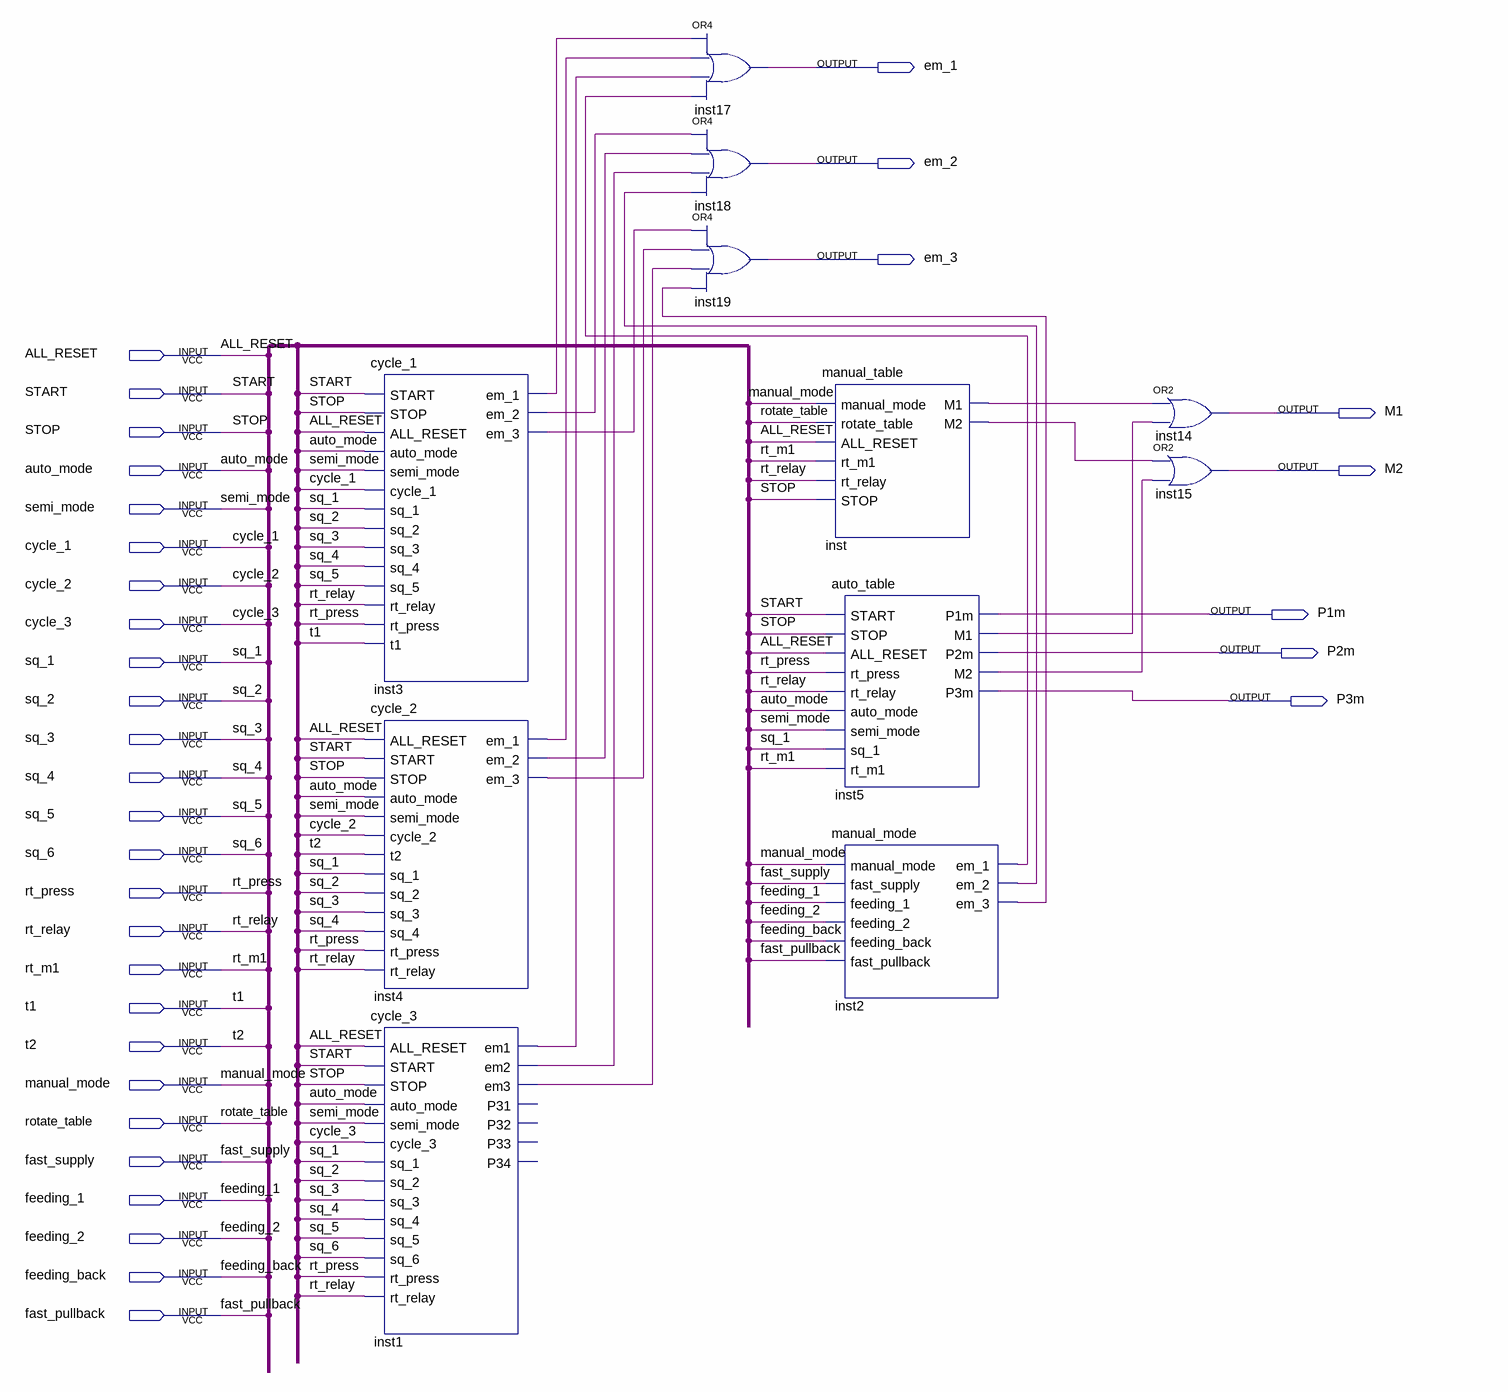
[diagram p0: schematic sheet]
// Quartus schematic kr_r_6.bdf as structural Verilog: 11 symbols, 34 pins
module kr_r_6 (
  input  ALL_RESET,
  input  START,
  input  STOP,
  input  auto_mode,
  input  semi_mode,
  input  cycle_1,
  input  cycle_2,
  input  cycle_3,
  input  sq_1,
  input  sq_2,
  input  sq_3,
  input  sq_4,
  input  sq_5,
  input  sq_6,
  input  rt_press,
  input  rt_relay,
  input  rt_m1,
  input  t1,
  input  t2,
  input  manual_mode,
  input  rotate_table,
  input  fast_supply,
  input  feeding_1,
  input  feeding_2,
  input  feeding_back,
  input  fast_pullback,
  output em_1,
  output em_2,
  output em_3,
  output M1,
  output M2,
  output P1m,
  output P2m,
  output P3m
);

  wire inst1_em1, inst1_em2, inst1_em3, inst2_em_1, inst2_em_2, inst2_em_3, inst3_em_1, inst3_em_2,
       inst3_em_3, inst4_em_1, inst4_em_2, inst4_em_3, inst5_m1, inst5_m2, inst_m1, inst_m2;

  cycle_1 inst3 (
    .START(START), .STOP(STOP), .ALL_RESET(ALL_RESET), .auto_mode(auto_mode), .semi_mode(semi_mode),
    .cycle_1(cycle_1), .sq_1(sq_1), .sq_2(sq_2), .sq_3(sq_3), .sq_4(sq_4), .sq_5(sq_5), .rt_relay(rt_relay),
    .rt_press(rt_press), .t1(t1), .em_1(inst3_em_1), .em_2(inst3_em_2), .em_3(inst3_em_3));
  cycle_2 inst4 (
    .ALL_RESET(ALL_RESET), .START(START), .STOP(STOP), .auto_mode(auto_mode), .semi_mode(semi_mode),
    .cycle_2(cycle_2), .t2(t2), .sq_1(sq_1), .sq_2(sq_2), .sq_3(sq_3), .sq_4(sq_4), .rt_press(rt_press),
    .rt_relay(rt_relay), .em_1(inst4_em_1), .em_2(inst4_em_2), .em_3(inst4_em_3));
  cycle_3 inst1 (
    .ALL_RESET(ALL_RESET), .START(START), .STOP(STOP), .auto_mode(auto_mode), .semi_mode(semi_mode),
    .cycle_3(cycle_3), .sq_1(sq_1), .sq_2(sq_2), .sq_3(sq_3), .sq_4(sq_4), .sq_5(sq_5), .sq_6(sq_6),
    .rt_press(rt_press), .rt_relay(rt_relay), .em1(inst1_em1), .em2(inst1_em2), .em3(inst1_em3));  // open: P31, P32, P33, P34
  or inst17 (em_1, inst3_em_1, inst4_em_1, inst1_em1, inst2_em_1);
  or inst18 (em_2, inst3_em_2, inst4_em_2, inst1_em2, inst2_em_2);
  or inst19 (em_3, inst3_em_3, inst4_em_3, inst1_em3, inst2_em_3);
  manual_table inst (
    .manual_mode(manual_mode), .rotate_table(rotate_table), .ALL_RESET(ALL_RESET), .rt_m1(rt_m1),
    .rt_relay(rt_relay), .STOP(STOP), .M1(inst_m1), .M2(inst_m2));
  auto_table inst5 (
    .START(START), .STOP(STOP), .ALL_RESET(ALL_RESET), .rt_press(rt_press), .rt_relay(rt_relay),
    .auto_mode(auto_mode), .semi_mode(semi_mode), .sq_1(sq_1), .rt_m1(rt_m1), .P1m(P1m), .M1(inst5_m1),
    .P2m(P2m), .M2(inst5_m2), .P3m(P3m));
  manual_mode inst2 (
    .manual_mode(manual_mode), .fast_supply(fast_supply), .feeding_1(feeding_1), .feeding_2(feeding_2),
    .feeding_back(feeding_back), .fast_pullback(fast_pullback), .em_1(inst2_em_1), .em_2(inst2_em_2),
    .em_3(inst2_em_3));
  or inst14 (M1, inst_m1, inst5_m1);
  or inst15 (M2, inst_m2, inst5_m2);
endmodule
